# Altium schematic sheet NodeSpeed.SchDoc: Motor Control Node
size A; DrawnBy: Trdat; Revision: V1.0; PageSetup: Record=PageOptions|CenterHorizontal=True|CenterVertical=True|PrintScale=1.00|XCorrection=1.00|YCorrection=1.00|PrintKind=0|BorderSize=5000000|LeftOffset=0|BottomOffset=0|Orientation=2|PaperLength=1000|PaperWidth=1000|Scale=100|PaperSource=7|PrintQuality=-3|MediaType=1|DitherType=10|PrintScaleMode=0|PaperKind=A4|PaperIndex=9
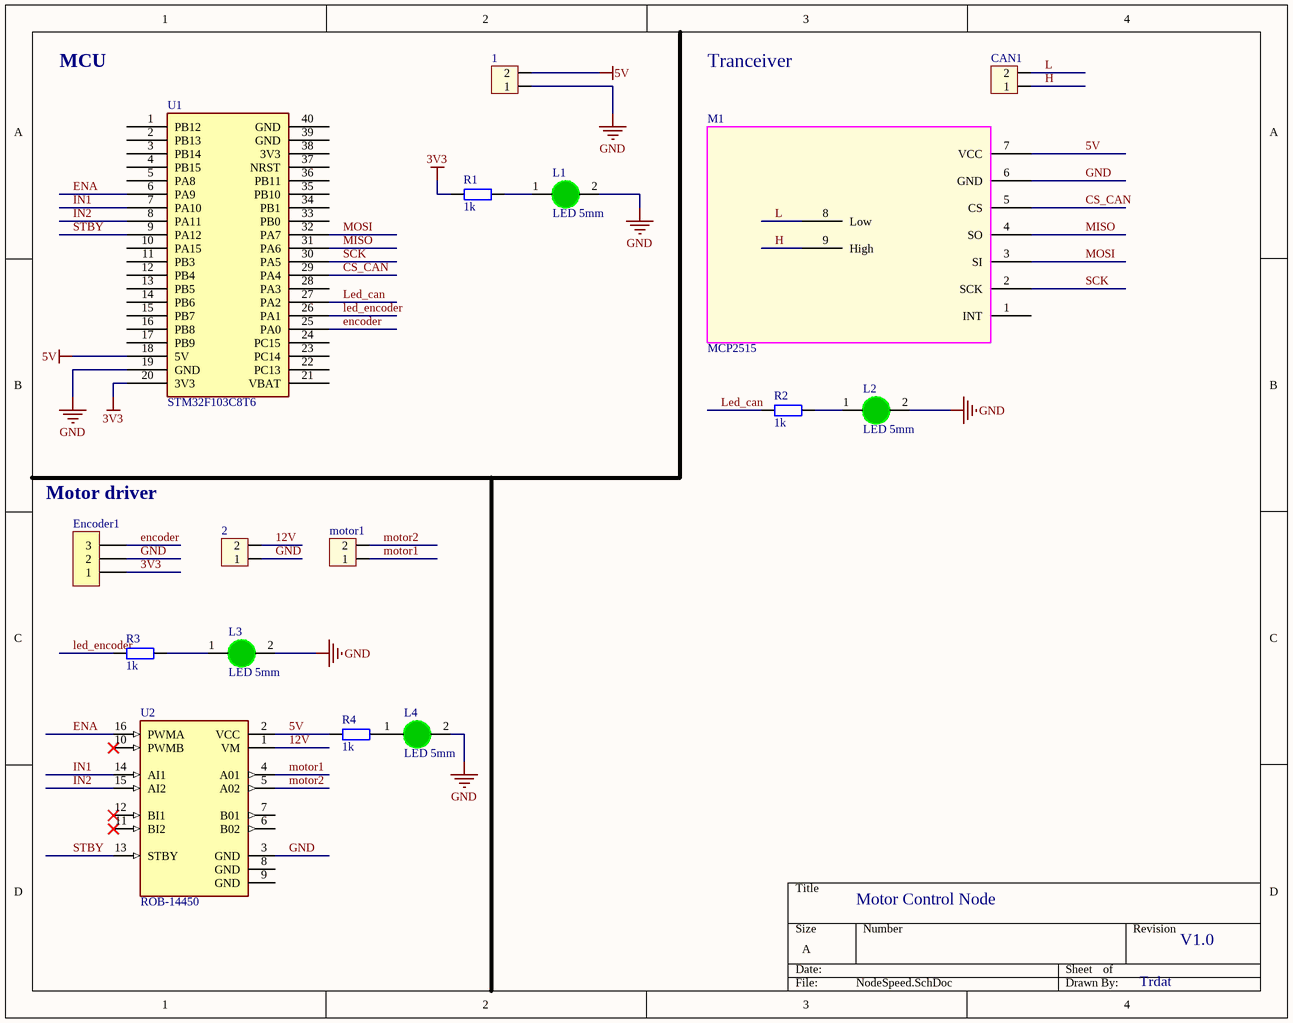
[diagram p0: NodeSpeed.SchDoc]

## Parts
1  Header 2P 2.54 Duc Cong  [Header 2P DC 2.54]  (value not drawn)
2  Header 2P 2.54 Duc Cong  [Header 2P DC 2.54]  (value not drawn)
CAN1  (no value)  [Header 2P DC 2.54]
Encoder1  Header 3P 2.54 Duc Cong  [Header 3P DC 2.54]  (value not drawn)
L1  LED 5mm  [LED-5MM-Green]
L2  LED 5mm  [LED-5MM-Green]
L3  LED 5mm  [LED-5MM-Green]
L4  LED 5mm  [LED-5MM-Green]
M1  MCP2515  [MCP2515_MODULE]
motor1  (no value)  [Header 2P DC 2.54]
R1  1k  [tro vach 1/4w]
R2  1k  [tro vach 1/4w]
R3  1k  [tro vach 1/4w]
R4  1k  [tro vach 1/4w]
U1  STM32F103C8T6  [Stm32 BluePill]
U2  ROB-14450  [MODULE_ROB-14450]

## Nets
3V3: Encoder1.1 R1.1 U1.20(3V3)
5V: 1.2 M1.7(VCC) R4.1 U1.18(5V) U2.2(VCC)
GND: 1.1 2.1 Encoder1.2 L1.2(K) L2.2(K) L3.2(K) L4.2(K) M1.6(GND) U1.19(GND) U2.3(GND)
12V: 2.2 U2.1(VM)
CS_CAN: M1.5(CS) U1.29(PA4)
ENA: U1.6(PA9) U2.16(PWMA)
encoder: Encoder1.3 U1.25(PA0)
H: CAN1.1 M1.9(High)
IN1: U1.7(PA10) U2.14(AI1)
IN2: U1.8(PA11) U2.15(AI2)
L: CAN1.2 M1.8(Low)
Led_can: R2.1 U1.27(PA2)
led_encoder: R3.1 U1.26(PA1)
MISO: M1.4(SO) U1.31(PA6)
MOSI: M1.3(SI) U1.32(PA7)
motor1: motor1.1 U2.4(A01)
motor2: motor1.2 U2.5(A02)
SCK: M1.2(SCK) U1.30(PA5)
STBY: U1.9(PA12) U2.13(STBY)
NetL1_1: L1.1(A) R1.2
NetL2_1: L2.1(A) R2.2
NetL3_1: L3.1(A) R3.2
NetL4_1: L4.1(A) R4.2

Not connected (* = marked no-connect by the designer): M1 1(INT); U1 1(PB12) 2(PB13) 3(PB14) 4(PB15) 5(PA8) 10(PA15) 11(PB3) 12(PB4) 13(PB5) 14(PB6) 15(PB7) 16(PB8) 17(PB9) 21(VBAT) 22(PC13) 23(PC14) 24(PC15) 28(PA3) 33(PB0) 34(PB1) 35(PB10) 36(PB11) 37(NRST) 38(3V3) 39(GND) 40(GND); U2 6(B02) 7(B01) 8(GND) 9(GND) 10(PWMB)* 11(BI2)* 12(BI1)*

## Notes on the sheet
- MCU
- Tranceiver
- (near Encoder1) Motor driver

## Library data of the parts
1 2 CAN1 motor1 = Header 2P 2.54 Duc Cong: Cắm; Ten_Linh_Kien: Header 2P XH2.54-2P Đực Cong; Don_Vi: Con; Ma_Hang: MH002852; Chung_Loai: Cắm
Encoder1 = Header 3P 2.54 Duc Cong: Cắm; Ten_Linh_Kien: Header 3P XH2.54-3P Đực Cong; Don_Vi: Con; Ma_Hang: MH001302; Chung_Loai: Cắm
L1-L4 = LED 5mm Xanh La: Cắm; Don_Vi: Con; Ma_Hang: MH008969; Ten_Linh_Kien: LED 5MM Phủ Xanh (1000c); Ghi_Chu: *; Kieu_Chan: *; Chung_Loai: Cắm
R1-R4 = Tro Vach 1/4W 5% 1k: Cắm; Don_Vi: Con; So_Chan: 2; Ten_Linh_Kien: Trở Vạch 1/4w 5% 1k; Ma_Hang: MH007390; Chung_Loai: Cắm; Kieu_Chan: *
U1 = BluePill: Designed By @Alixahedi
U2 = ROB-14450: TB6612FNG Motor Controller/Driver Power Management Evaluation Board; MF: SparkFun Electronics; Check_prices: https://www.snapeda.com/parts/ROB-14450/SparkFun%20Electronics/view-part/2656367/?ref=eda; Package: None; MP: ROB-14450; Value: *; Availability: In Stock; SnapEDA_Link: https://www.snapeda.com/parts/ROB-14450/SparkFun%20Electronics/view-part/2656367/?ref=snap; Price: None